# Altium project PCB_Project1.PrjPCB
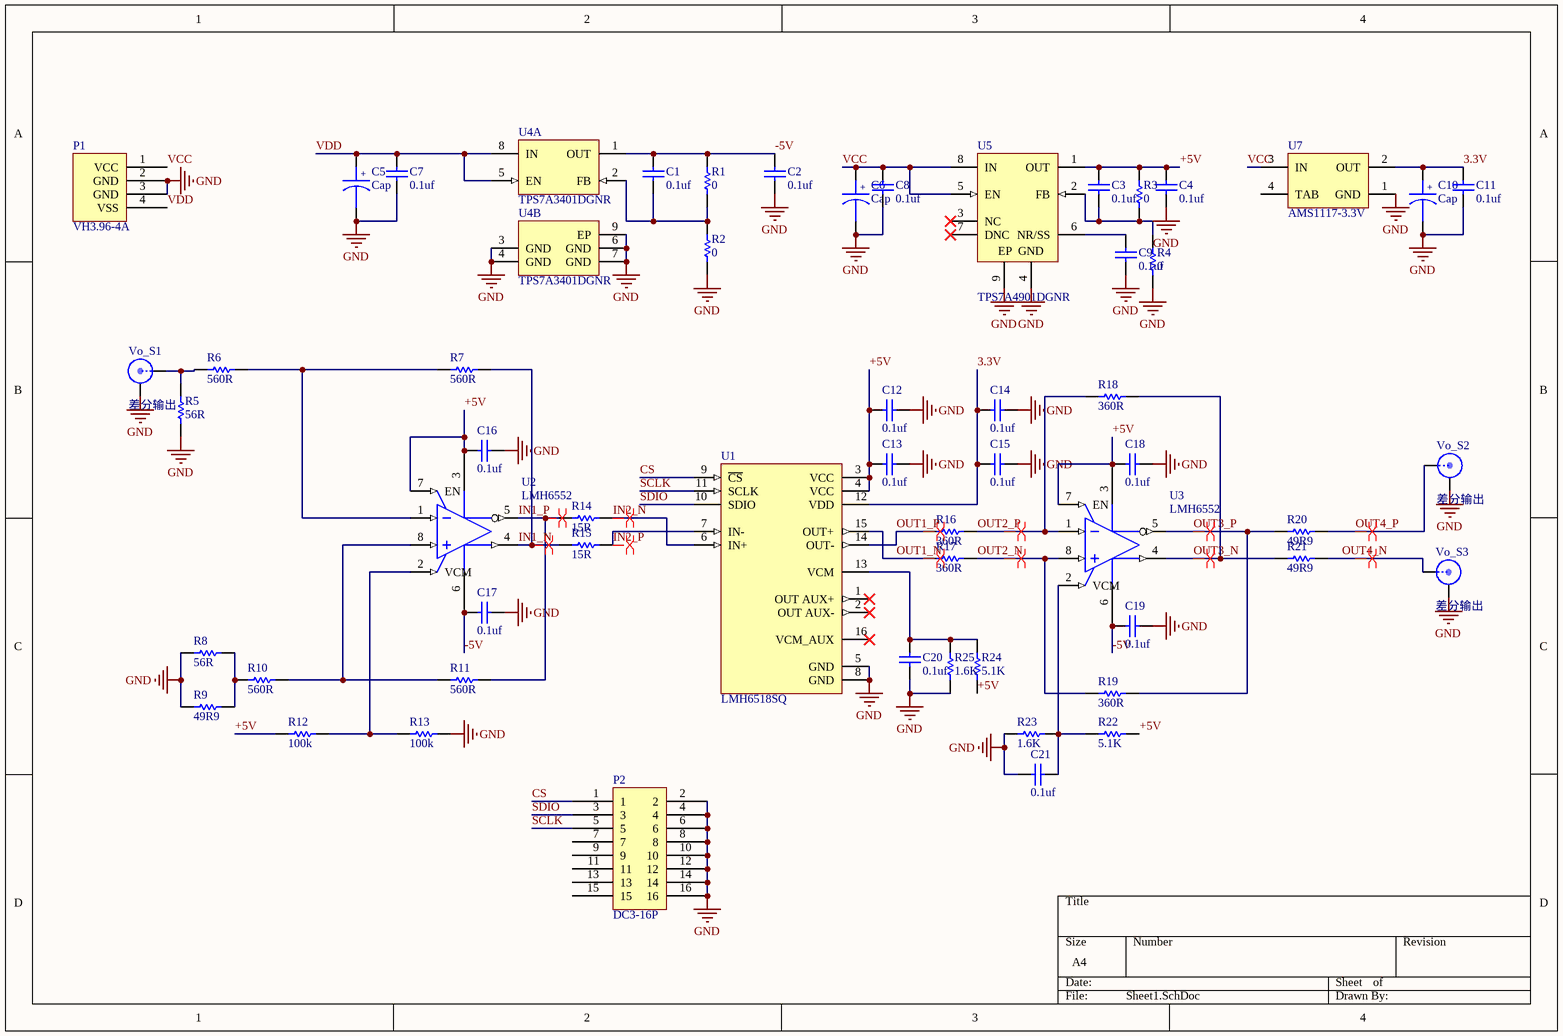
[diagram p0: Sheet1.SchDoc]
1 sheet, 57 parts. Net scope: global (net labels, ports and power ports of the same name join across sheets).
Board file: PCB1.PcbDoc

## Sheet Sheet1.SchDoc
size A4

### Parts
C1  0.1uf  [0805]
C2  0.1uf  [0805]
C3  0.1uf  [0805]
C4  0.1uf  [0805]
C5  Cap  [7343C-TYPE_D]
C6  Cap  [7343C-TYPE_D]
C7  0.1uf  [0805]
C8  0.1uf  [0805]
C9  0.1uf  [0805]
C10  Cap  [3216C-TYPE_A]
C11  0.1uf  [0805]
C12  0.1uf  [0603C]
C13  0.1uf  [0603C]
C14  0.1uf  [0603C]
C15  0.1uf  [0603C]
C16  0.1uf  [0805]
C17  0.1uf  [0805]
C18  0.1uf  [0805]
C19  0.1uf  [0805]
C20  0.1uf  [0603C]
C21  0.1uf  [0603C]
P1  VH3.96-4A  [VH3.96-4P]
P2  DC3-16P  [DC3-14P]
R1  0  [0805]
R2  0  [0805]
R3  0  [0805]
R4  0  [0805]
R5  56R  [0603R]
R6  560R  [0603R]
R7  560R  [0603R]
R8  56R  [0603R]
R9  49R9  [0603R]
R10  560R  [0603R]
R11  560R  [0603R]
R12  100k  [0603R]
R13  100k  [0603R]
R14  15R  [0603R]
R15  15R  [0603R]
R16  360R  [0603R]
R17  360R  [0603R]
R18  360R  [0603R]
R19  360R  [0603R]
R20  49R9  [0603R]
R21  49R9  [0603R]
R22  5.1K  [0603R]
R23  1.6K  [0603R]
R24  5.1K  [0603R]
R25  1.6K  [0603R]
U1  LMH6518SQ  [SQA16A]
U2  LMH6552  [TI-D8_M]
U3  LMH6552  [TI-D8_M]
U4  TPS7A3401DGNR  [TI-DGN8-1760X1425TP_N]  (parts A,B of 2)
U5  TPS7A4901DGNR  [TI-DGN8-1760X1425TP_L]
U7  AMS1117-3.3V  [SOT-223]
Vo_S1  差分输出  [SMA-LYING]
Vo_S2  差分输出  [SMA-LYING]
Vo_S3  差分输出  [SMA-LYING]

### Nets
GND: C2.1 C4.1 C5.2 C6.2 C7.1 C8.1 C9.1 C10.2 C11.1 C12.2 C13.2 C14.2 C15.2 C16.2 C17.2 C18.1 C19.1 C20.1 C21.2 P1.2(GND) P1.3(GND) P2.2 P2.4 P2.6 P2.8 P2.10 P2.12 P2.14 P2.16 R2.1 R4.1 R5.1 R8.2 R9.2 R13.1 R23.2 R25.2 U1.5(GND) U1.8(GND) U4.3(GND) U4.4(GND) U4.6(GND) U4.7(GND) U4.9(EP) U5.4(GND) U5.9(EP) U7.1(GND) Vo_S1.1 Vo_S2.1 Vo_S3.1
3.3V: C10.1 C11.2 C14.1 C15.1 U1.12(VDD) U7.2(OUT)
+5V: C3.2 C4.2 C12.1 C13.1 C16.1 C18.2 R3.2 R12.2 R22.1 R24.2 U1.3(VCC) U1.4(VCC) U2.3(VCC) U2.7(EN) U3.3(VCC) U3.7(EN) U5.1(OUT)
-5V: C1.2 C2.2 C17.1 C19.2 R1.2 U2.6(VDD) U3.6(VDD) U4.1(OUT)
CS: P2.1 U1.9(~{CS})
IN1_N: R7.1 R15.2 U2.4(Q)
IN1_P: R11.1 R14.2 U2.5(~{Q})
IN2_N: R14.1 U1.6(IN+)
IN2_P: R15.1 U1.7(IN-)
OUT1_N: R17.2 U1.15(OUT+)
OUT1_P: R16.2 U1.14(OUT-)
OUT2_N: R17.1 R19.2 U3.8(VP)
OUT2_P: R16.1 R18.2 U3.1(VN)
OUT3_N: R18.1 R21.1 U3.4(Q)
OUT3_P: R19.1 R20.1 U3.5(~{Q})
OUT4_N: R21.2 Vo_S3.0
OUT4_P: R20.2 Vo_S2.0
SCLK: P2.5 U1.11(SCLK)
SDIO: P2.3 U1.10(SDIO)
VCC: C6.1 C8.2 P1.1(VCC) U5.5(EN) U5.8(IN) U7.3(IN)
VDD: C5.1 C7.2 P1.4(VSS) U4.5(EN) U4.8(IN)
NetC1_1: C1.1 R1.1 R2.2 U4.2(FB)
NetC3_1: C3.1 R3.1 R4.2 U5.2(FB)
NetC9_2: C9.2 U5.6(NR/SS)
NetC20_2: C20.2 R24.1 R25.1 U1.13(VCM)
NetC21_1: C21.1 R22.2 R23.1 U3.2(VCM)
NetR5_2: R5.2 R6.2 Vo_S1.0
NetR6_1: R6.1 R7.2 U2.1(VN)
NetR8_1: R8.1 R9.1 R10.2
NetR10_1: R10.1 R11.2 U2.8(VP)
NetR12_1: R12.1 R13.2 U2.2(VCM)

Not connected (* = marked no-connect by the designer): P2 7 9 11 13 15; U1 1(OUT_AUX+)* 2(OUT_AUX-)* 16(VCM_AUX)*; U5 3(NC)* 7(DNC)*; U7 4(TAB)

### Layout directives
differential pair: IN1_N, IN1_P, IN2_N, IN2_P, OUT1_N, OUT1_P, OUT2_N, OUT2_P, OUT3_N, OUT3_P, OUT4_N, OUT4_P

### Notes on the sheet
- (in symbol Tantalium Cap) +
- (in symbol Cap) +

### Library data of the parts
C1-C4 C7-C9 C11-C21 = Cap
C5 C6 C10 = Tantalium Cap
R1-R25 = Res
U1 = LMH6518SQ: 900 MHz, Digitally Controlled, Variable Gain Amplifier, 16-pin LLP; Manufacturer: National Semiconductor; PackageTopMarking: NS*UZXYTT*L6518SQ; PowerWise: Y; CompType: Amplifiers; DatasheetVersion: Oct-2008; PackageVersion: revA, Oct-2003; PackageReference: SQA16A; PackageDescription: LLP, Plastic, Quad, 4 x 4 x 0.8mm Body, 16 Lead, 0.5mm Pitch, No Pullback; PartNumber: LMH6518; RoHS: Y; PinCount: 16; High-Reliability: Y; ComponentLink1Description: Manufacturer URL; ComponentLink1URL: http://www.national.com/; ComponentLink2Description: LMH6518 Datasheet; ComponentLink2URL: http://www.national.com/ds/LM/LMH6518.pdf; ComponentLink3Description: LMH6518 Web Page; ComponentLink3URL: http://www.national.com/pf/LM/LMH6518.html; ComponentLink4Description: SQA16A Package Page; ComponentLink4URL: http://www.national.com/packaging/folders/sqa16a.html
U4 = TPS7A3401DGNR: Single Output Low Noise LDO, 200 mA, Adjustable -1.18 to -18 V Output, -3 to -20 V Input, 8-pin MSOP (DGN), -40 to 125 degC, Green (RoHS & no Sb/Br); Manufacturer: Texas Instruments; Accuracy(%): 1.5; Iout(Max)(A): 0.2; Iq(Typ)(mA): 0.05; SubFamily: Single Channel LDO; Vdo(Typ)(mV): 216; DatasheetVersion: SBVS163; PackageVersion: 4073271/F; PackageReference: DGN8-1760X1425TP; PackageDescription: 8-pin Plastic Small Outline, Body 3 x 3 mm, Pitch 0.65 mm; Eco-Plan: Green (RoHS & no Sb/Br); Vin(Max)(V): -20; Vin(Min)(V): -3; Vout Adj(Max)(V): -18; Vout Adj(Min)(V): -1.18; Mounting Technology: Surface Mount; Code_JEDEC: MO-187; PartNumber: TPS7A3401DGNR; ComponentLink1Description: Manufacturer URL; ComponentLink1URL: http://www.ti.com/; ComponentLink2Description: Datasheet; ComponentLink2URL: http://www.ti.com/general/docs/lit/getliterature.tsp?genericPartNumber=TPS7A3401&fileType=pdf; ComponentLink3Description: Package Specification; ComponentLink3URL: http://www.ti.com/litv/pdf/mpds046e
U5 = TPS7A4901DGNR: Single Output High PSRR LDO, 150 mA, Adjustable 1.2 to 33 V Output, 3 to 36 V Input, with Ultra-Low Noise, 8-pin MSOP (DGN), -40 to 125 degC, Green (RoHS & no Sb/Br); Manufacturer: Texas Instruments; Accuracy(%): 1.5; Iout(Max)(A): 0.15; Iq(Typ)(mA): 0.06; Power Good: TRUE; SubFamily: Single Channel LDO; Vdo(Typ)(mV): 260; Vin(Max)(V): 36; Vin(Min)(V): 3; Vout Adj(Max)(V): 33; Vout Adj(Min)(V): 1.2; DatasheetVersion: SBVS121B; PackageVersion: 4073271/F; PackageReference: DGN8-1760X1425TP; PackageDescription: 8-pin Plastic Small Outline, Body 3 x 3 mm, Pitch 0.65 mm; Eco-Plan: Green (RoHS & no Sb/Br); Mounting Technology: Surface Mount; Code_JEDEC: MO-187; PartNumber: TPS7A4901DGNR; ComponentLink1Description: Manufacturer URL; ComponentLink1URL: http://www.ti.com/; ComponentLink2Description: Datasheet; ComponentLink2URL: http://www.ti.com/general/docs/lit/getliterature.tsp?genericPartNumber=TPS7A4901&fileType=pdf; ComponentLink3Description: Package Specification; ComponentLink3URL: http://www.ti.com/litv/pdf/mpds046e
Vo_S1-Vo_S3 = SMA